# Altium schematic sheet Level Shifter.SchDoc: Level Shifter
size A4; SheetNumber: 4; SheetTotal: 4
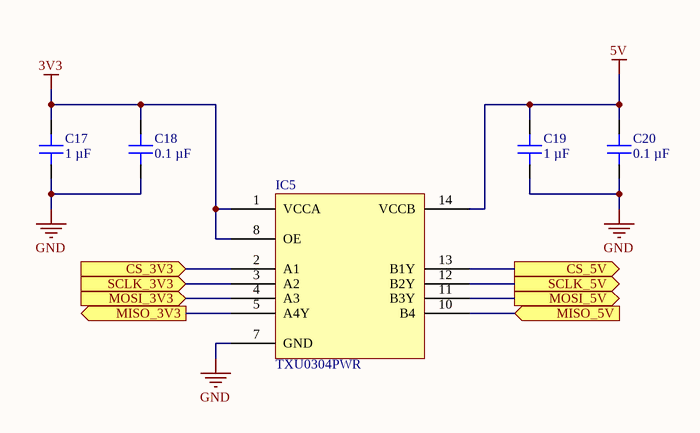
[diagram p0: Level Shifter.SchDoc]

## Parts
C17  1 µF  [CAP 0603_1608]
C18  0.1 µF  [CAP 0603_1608]
C19  1 µF  [CAP 0603_1608]
C20  0.1 µF  [CAP 0603_1608]
IC5  TXU0304PWR  [TI TSSOP-14 PW]

## Ports
CS_3V3 (in), CS_5V (out), MISO_3V3 (out), MISO_5V (in), MOSI_3V3 (in), MOSI_5V (out), SCLK_3V3 (in), SCLK_5V (out)

## Nets
3V3: C17.2 C18.1 IC5.1(VCCA) IC5.8(OE)
5V: C19.2 C20.1 IC5.14(VCCB)
GND: C17.1 C18.2 C19.1 C20.2 IC5.7(GND)
CS_3V3: IC5.2(A1) ; port CS_3V3
CS_5V: IC5.13(B1Y) ; port CS_5V
MISO_3V3: IC5.5(A4Y) ; port MISO_3V3
MISO_5V: IC5.10(B4) ; port MISO_5V
MOSI_3V3: IC5.4(A3) ; port MOSI_3V3
MOSI_5V: IC5.11(B3Y) ; port MOSI_5V
SCLK_3V3: IC5.3(A2) ; port SCLK_3V3
SCLK_5V: IC5.12(B2Y) ; port SCLK_5V

## Notes on the sheet
- Title
- Size:
- Date:
- A4
- Number:
- Time:
- Revision:
- Sheet
- of
- File:

## Library data of the parts
C17 C19 = GCM188R71E105KA64D: CAP CER 1UF 25V X7R 0603; manufacturer: Murata Electronics; Tolerance: ±10%; Part Number: GCM188R71E105KA64D; Value: 1 µF; Applications: Automotive; Capacitance: 1 µF; componentlink1description: Datasheet; componentlink1url: https://www.murata.com/~/media/webrenewal/support/library/catalog/products/capacitor/mlcc/c03e.ashx?la=en-us; componentlink2description: DigiKey Link; componentlink2url: https://www.digikey.com/en/products/detail/murata-electronics/GCM188R71E105KA64D/4903956; Device Package: 0603 (1608 Metric); lastupdated: 20/08/2023 19:09:04; Lifecycle Status: Active; Minimum Order: 1; Mounting Type: Surface Mount, MLCC; Operating Temperature: -55°C ~ 125°C; Package / Case: 0603 (1608 Metric); packaging: TapeAndReel; partid: 6762; Part Status: Active; price: 0.03; Ratings: AEC-Q200; series: GCM; Size / Dimension: 0.063" L x 0.031" W (1.60mm x 0.80mm); Supplier 1: DigiKey; Supplier Part Number 1: 490-10673-1-ND; Temperature Coefficient: X7R; Thickness (Max): 0.035" (0.90mm); Voltage - Rated: 25V
C18 C20 = CL10B104KB8NNNC: CAP CER 0.1UF 50V X7R 0603; manufacturer: Samsung Electro-Mechanics; Tolerance: ±10%; Part Number: CL10B104KB8NNNC; Value: 0.1 µF; Applications: General Purpose; Capacitance: 0.1 µF; componentlink1description: Datasheet; componentlink1url: http://www.samsungsem.com/kr/support/product-search/mlcc/CL10B104KB8NNNC.jsp; componentlink2description: DigiKey Link; componentlink2url: https://www.digikey.com/en/products/detail/samsung-electro-mechanics/CL10B104KB8NNNC/3886658; Device Package: 0603 (1608 Metric); lastupdated: 02/11/2023 19:13:06; Lifecycle Status: Active; Minimum Order: 1; Mounting Type: Surface Mount, MLCC; Operating Temperature: -55°C ~ 125°C; Package / Case: 0603 (1608 Metric); packaging: TapeAndReel; partid: 9788; Part Status: Active; price: 0.01; series: CL; Size / Dimension: 0.063" L x 0.031" W (1.60mm x 0.80mm); Supplier 1: DigiKey; Supplier Part Number 1: 1276-1000-1-ND; Temperature Coefficient: X7R; Thickness (Max): 0.035" (0.90mm); Voltage - Rated: 50V
IC5 = TXU0304PWR: IC TRANSLATOR UNIDIR 14TSSOP; Manufacturer: Texas Instruments; Channels per Circuit: 4; Channel Type: Unidirectional; Data Rate: 200Mbps; Number of Circuits: 1; Output Type: Tri-State; Translator Type: Voltage Level; Voltage - VCCA: 1.08 V ~ 5.5 V; Part Number: TXU0304PWR; ComponentLink1Description: Datasheet; ComponentLink1URL: https://www.ti.com/general/docs/suppproductinfo.tsp?distId=10&gotoUrl=http%3A%2F%2Fwww.ti.com%2Flit%2Fgpn%2Ftxu0304; ComponentLink2Description: DigiKey Link; ComponentLink2URL: https://www.digikey.com/en/products/detail/texas-instruments/TXU0304PWR/14641423; LastUpdated: 16/03/2024 20:45:15; Lifecycle Status: Active; Minimum Order: 1; Mounting Type: Surface Mount; Operating Temperature: -40°C ~ 125°C (TA); Packaging: TapeAndReel; Part Status: Active; Price: 0.32; Series: -; Supplier 1: DigiKey; Supplier Part Number 1: 296-TXU0304PWRCT-ND; Supplier Device Package: 14-TSSOP; Voltage - VCCB: 1.08 V ~ 5.5 V